# EasyEDA schematic SCH_nrf-chip-pcb_2025-12-10.json
TITLE: Sheet_1; REV: 1.0; Date: 2025-10-01; Sheet: 1/1; Drawn By: b24269; Company: Your Company
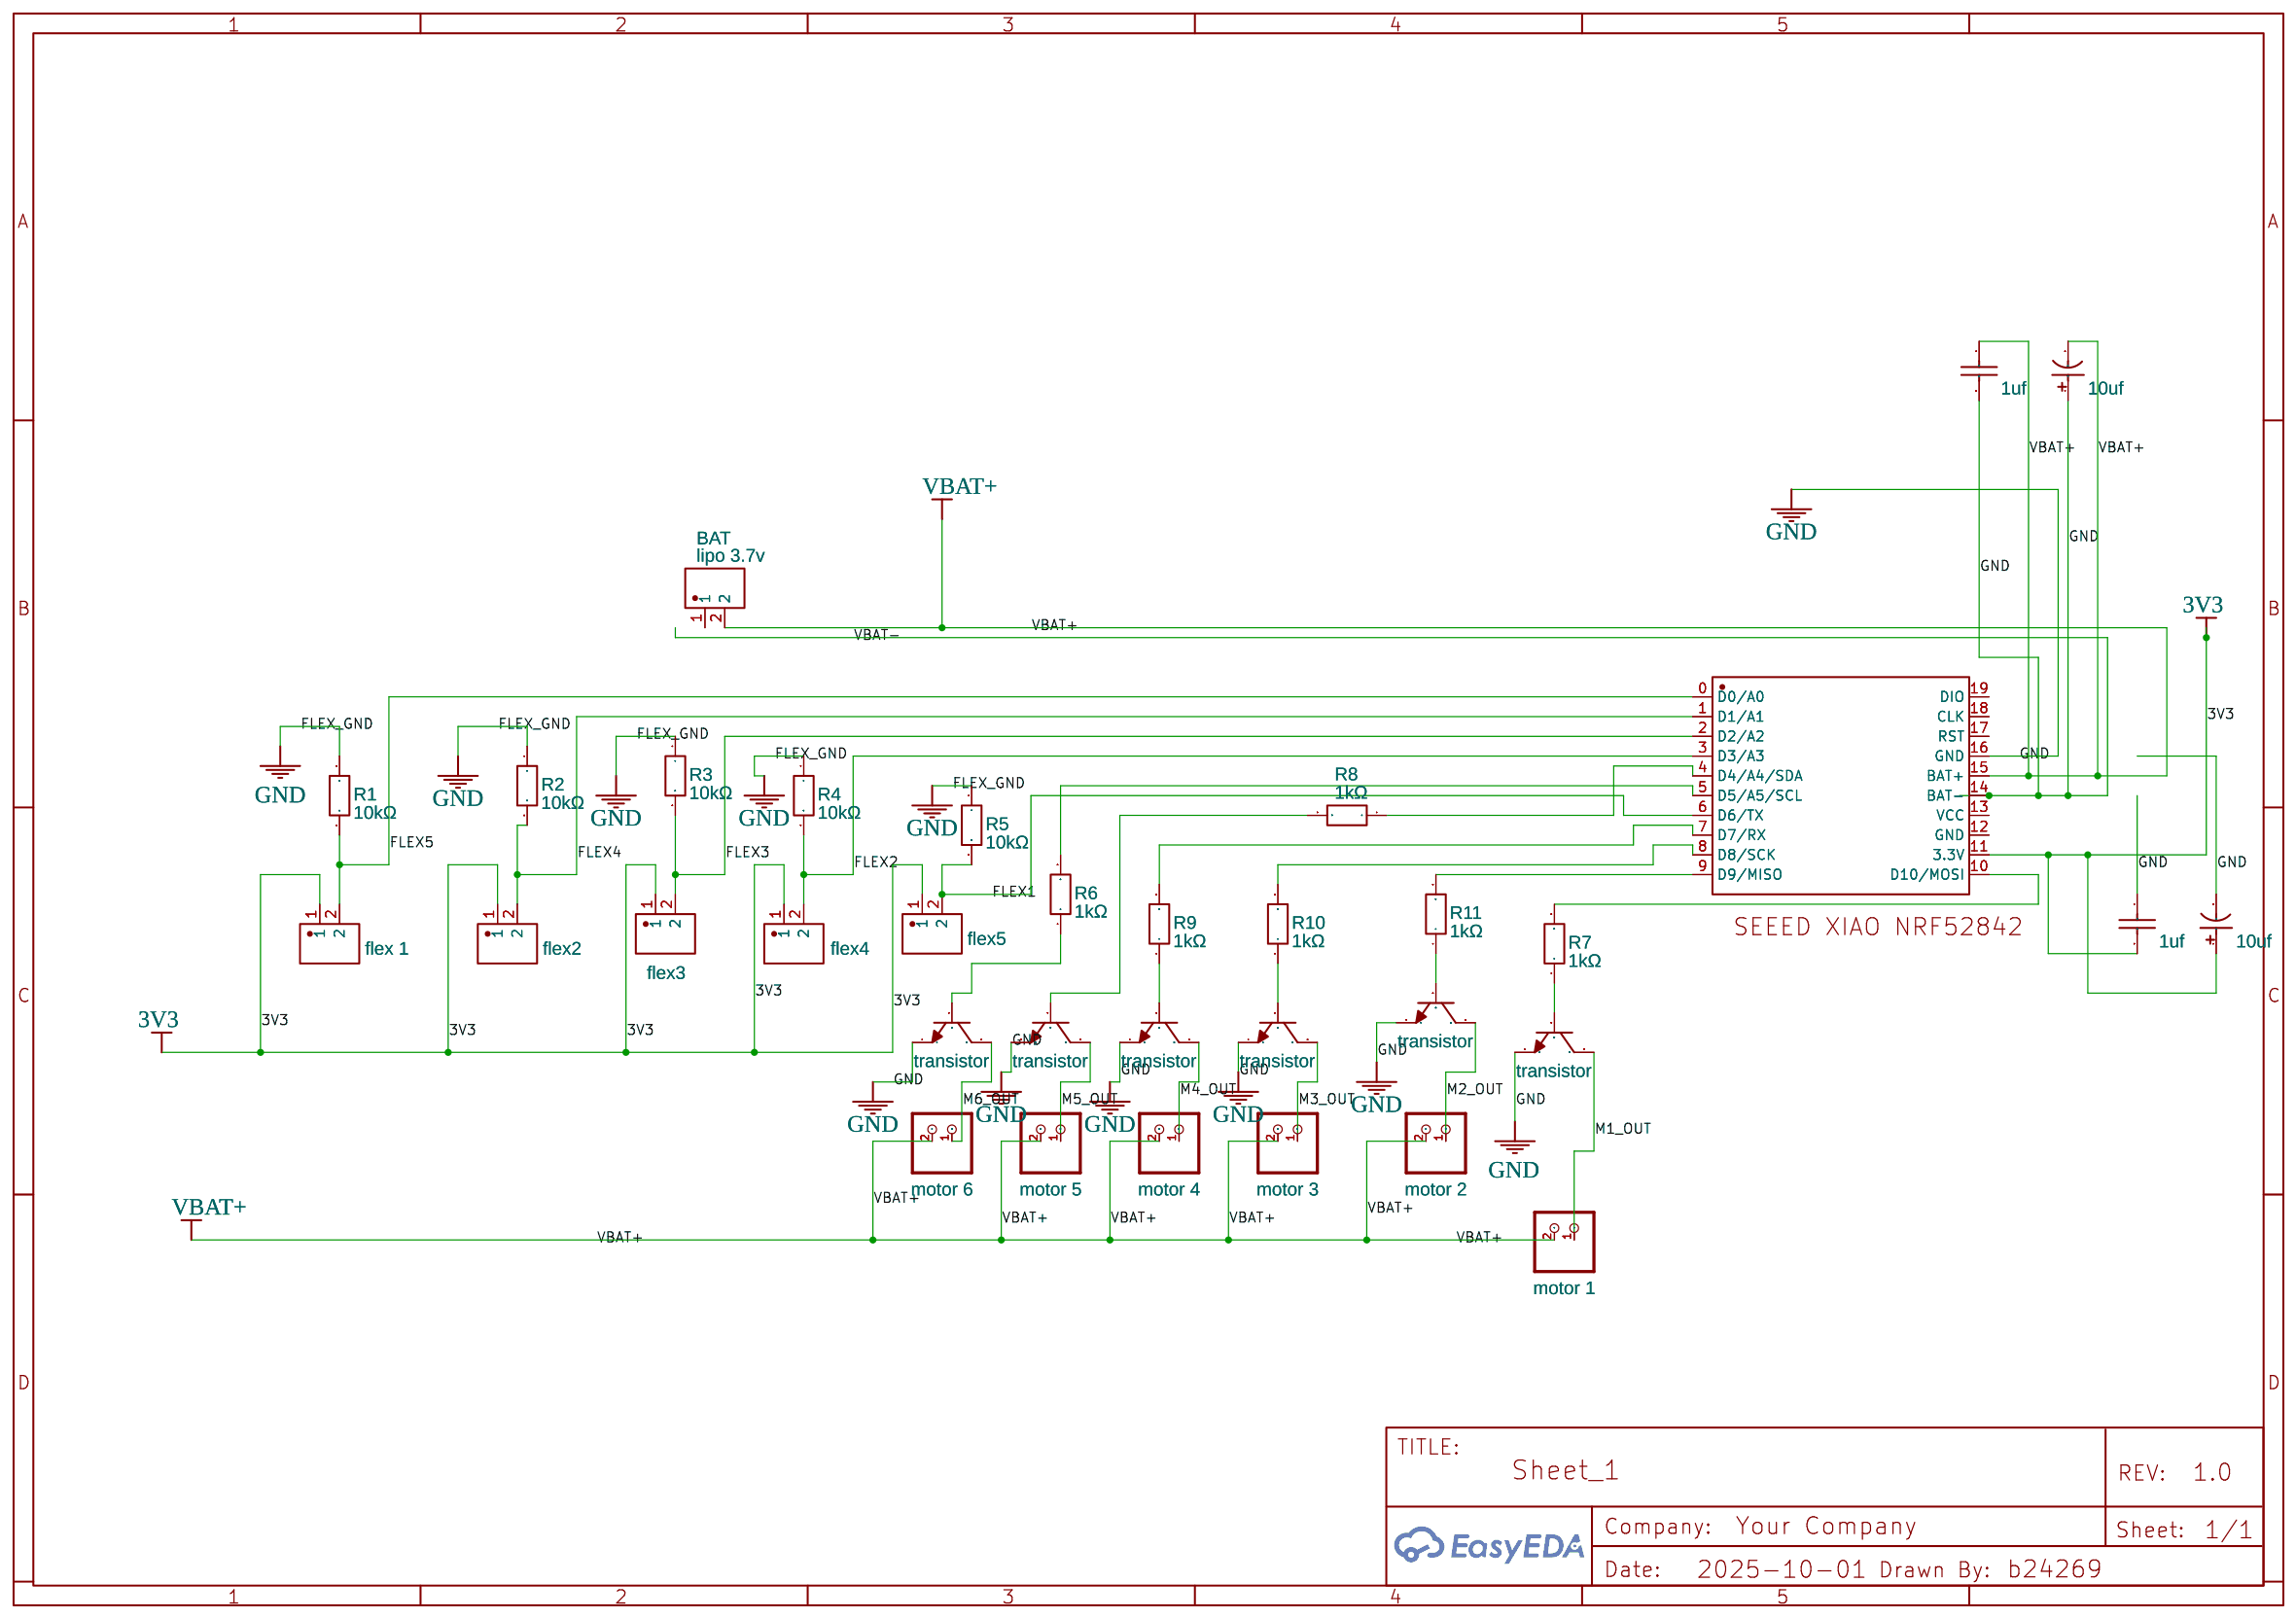
[diagram p0: schematic sheet]

## Parts
3V3CAP1  1uf  [CAPC1608X90N]
3V3CAP10  10uf  [CAP. ELECTROLYTIC TH. 5X11]
BAT  lipo 3.7v  [CONN-TH_2.0-2P-ZZDK-R-PCB-CONNECTOR]
BATCAP1  1uf  [CAPC1608X90N]
BATCAP10  10uf  [CAP. ELECTROLYTIC TH. 5X11]
M1  motor 1  [JST-PH-2-THM]
M2  motor 2  [JST-PH-2-THM]
M3  motor 3  [JST-PH-2-THM]
M4  motor 4  [JST-PH-2-THM]
M5  motor 5  [JST-PH-2-THM]
M6  motor 6  [JST-PH-2-THM]
NRF  SEEED XAIO NRF52840  [SEEED XIAO NRF52840]
Q1  transistor  [SOT-23-3_L2.9-W1.3-P1.90-LS2.4-TR]
Q2  transistor  [SOT-23-3_L2.9-W1.3-P1.90-LS2.4-TR]
Q3  transistor  [SOT-23-3_L2.9-W1.3-P1.90-LS2.4-TR]
Q4  transistor  [SOT-23-3_L2.9-W1.3-P1.90-LS2.4-TR]
Q5  transistor  [SOT-23-3_L2.9-W1.3-P1.90-LS2.4-TR]
Q6  transistor  [SOT-23-3_L2.9-W1.3-P1.90-LS2.4-TR]
R1  10kΩ  [R0603]
R2  10kΩ  [R0603]
R3  10kΩ  [R0603]
R4  10kΩ  [R0603]
R5  10kΩ  [R0603]
R6  1kΩ  [R0603]
R7  1kΩ  [R0603]
R8  1kΩ  [R0603]
R9  1kΩ  [R0603]
R10  1kΩ  [R0603]
R11  1kΩ  [R0603]
U1  flex5  [HDR-TH_2P-P2.54-V-F]
U2  flex 1  [HDR-TH_2P-P2.54-V-F]
U3  flex2  [HDR-TH_2P-P2.54-V-F]
U4  flex3  [HDR-TH_2P-P2.54-V-F]
U5  flex4  [HDR-TH_2P-P2.54-V-F]

## Library data of the parts
3V3CAP1 BATCAP1 = Capacitor MLCC 0.1uF 25V 0603: Height: 0.87mm; Manufacturer Part Number: FN18X104K500PBG; Case: 0603; LCSC Part Number: C235731; Contributor: oleg63
3V3CAP10 BATCAP10 = UVZ1E100MDD1TA: Manufacturer: Nichicon; Supplier: Digi-Key; Supplier Part: 493-16448-1-ND; link: https://www.digikey.ca/en/products/detail/nichicon/UVZ1E100MDD1TA/4995486; Contributor: optechalexd
BAT = 2.0-2P ZZDK-R PCB CONNECTOR: Supplier: LCSC; Supplier Part: C49023773; Manufacturer: SHOU HAN(首韩); Manufacturer Part: 2.0-2P ZZDK-R PCB Connector; JLCPCB Part Class: Extended Part; Contributor: lcsc
M1-M6 = JST_2PIN-THM: Contributor: Thore Krug
NRF = SEEED XAIO NRF52840: Contributor: kanuriudayashankar87
Q1-Q6 = 2N3904(SOT-23): Supplier: LCSC; Manufacturer: KEC; Manufacturer Part: 2n3904S-RTK/PS; Supplier Part: C18536; Paste Type: SOT-23; Contributor: LCEDA_Lib
R1-R5 = TFCR0603-10W-C-1002FT: Supplier: LCSC; Supplier Part: C4037161; Manufacturer: Venkel; JLCPCB Part Class: Extended Part; Contributor: lcsc
R6-R11 = PTFR0603Q1K00N9: Supplier: LCSC; Supplier Part: C23067434; Manufacturer: RESI(开步睿思); Contributor: lcsc; JLCPCB Part Class: Extended Part
U1-U5 = 5BML8-11732-102-W0: Supplier: LCSC; Supplier Part: C39832996; Manufacturer: SAMZO(三佐); JLCPCB Part Class: Extended Part; Contributor: lcsc

## Nets
3V3: 3V3CAP1.2 3V3CAP10.1 NRF.11(3.3V) U1.1 U2.1 U3.1 U4.1 U5.1
VBAT+: BAT.2 BATCAP1.1 BATCAP10.2 M1.2(1) M2.2(1) M3.2(1) M4.2(1) M5.2(1) M6.2(1) NRF.15(BAT+)
FLEX1: NRF.6(D6/TX) R5.2 U1.2
FLEX2: NRF.3(D3/A3) R4.2 U5.2
FLEX3: NRF.2(D2/A2) R3.2 U4.2
FLEX4: NRF.1(D1/A1) R2.2 U3.2
FLEX5: NRF.0(D0/A0) R1.2 U2.2
FLEX_GND: 3V3CAP1.1 3V3CAP10.2 BATCAP1.2 BATCAP10.1 NRF.14(BAT-) NRF.16(GND) Q1.1(E) Q2.1(E) Q3.1(E) Q4.1(E) Q5.1(E) Q6.1(E) R1.1 R2.1 R3.1 R4.1 R5.1
M1_OUT: M1.1(2) Q1.3(C)
M2_OUT: M2.1(2) Q2.3(C)
M3_OUT: M3.1(2) Q3.3(C)
M4_OUT: M4.1(2) Q4.3(C)
M5_OUT: M5.1(2) Q5.3(C)
M6_OUT: M6.1(2) Q6.3(C)
Net-(NRF-4): NRF.4(D4/A4/SDA) R8.1
Net-(NRF-5): NRF.5(D5/A5/SCL) R6.2
Net-(NRF-7): NRF.7(D7/RX) R9.2
Net-(NRF-8): NRF.8(D8/SCK) R10.2
Net-(NRF-9): NRF.9(D9/MISO) R11.2
Net-(NRF-10): NRF.10(D10/MOSI) R7.2
Net-(Q1-2): Q1.2(B) R7.1
Net-(Q2-2): Q2.2(B) R11.1
Net-(Q3-2): Q3.2(B) R10.1
Net-(Q4-2): Q4.2(B) R9.1
Net-(Q5-2): Q5.2(B) R8.2
Net-(Q6-2): Q6.2(B) R6.1

Not connected (* = marked no-connect by the designer): BAT 1; NRF 12(GND) 13(VCC) 17(RST) 18(CLK) 19(DIO)
